# EasyEDA Pro project 第十届农装PCB工程.epro, board 驱动板_2024_8
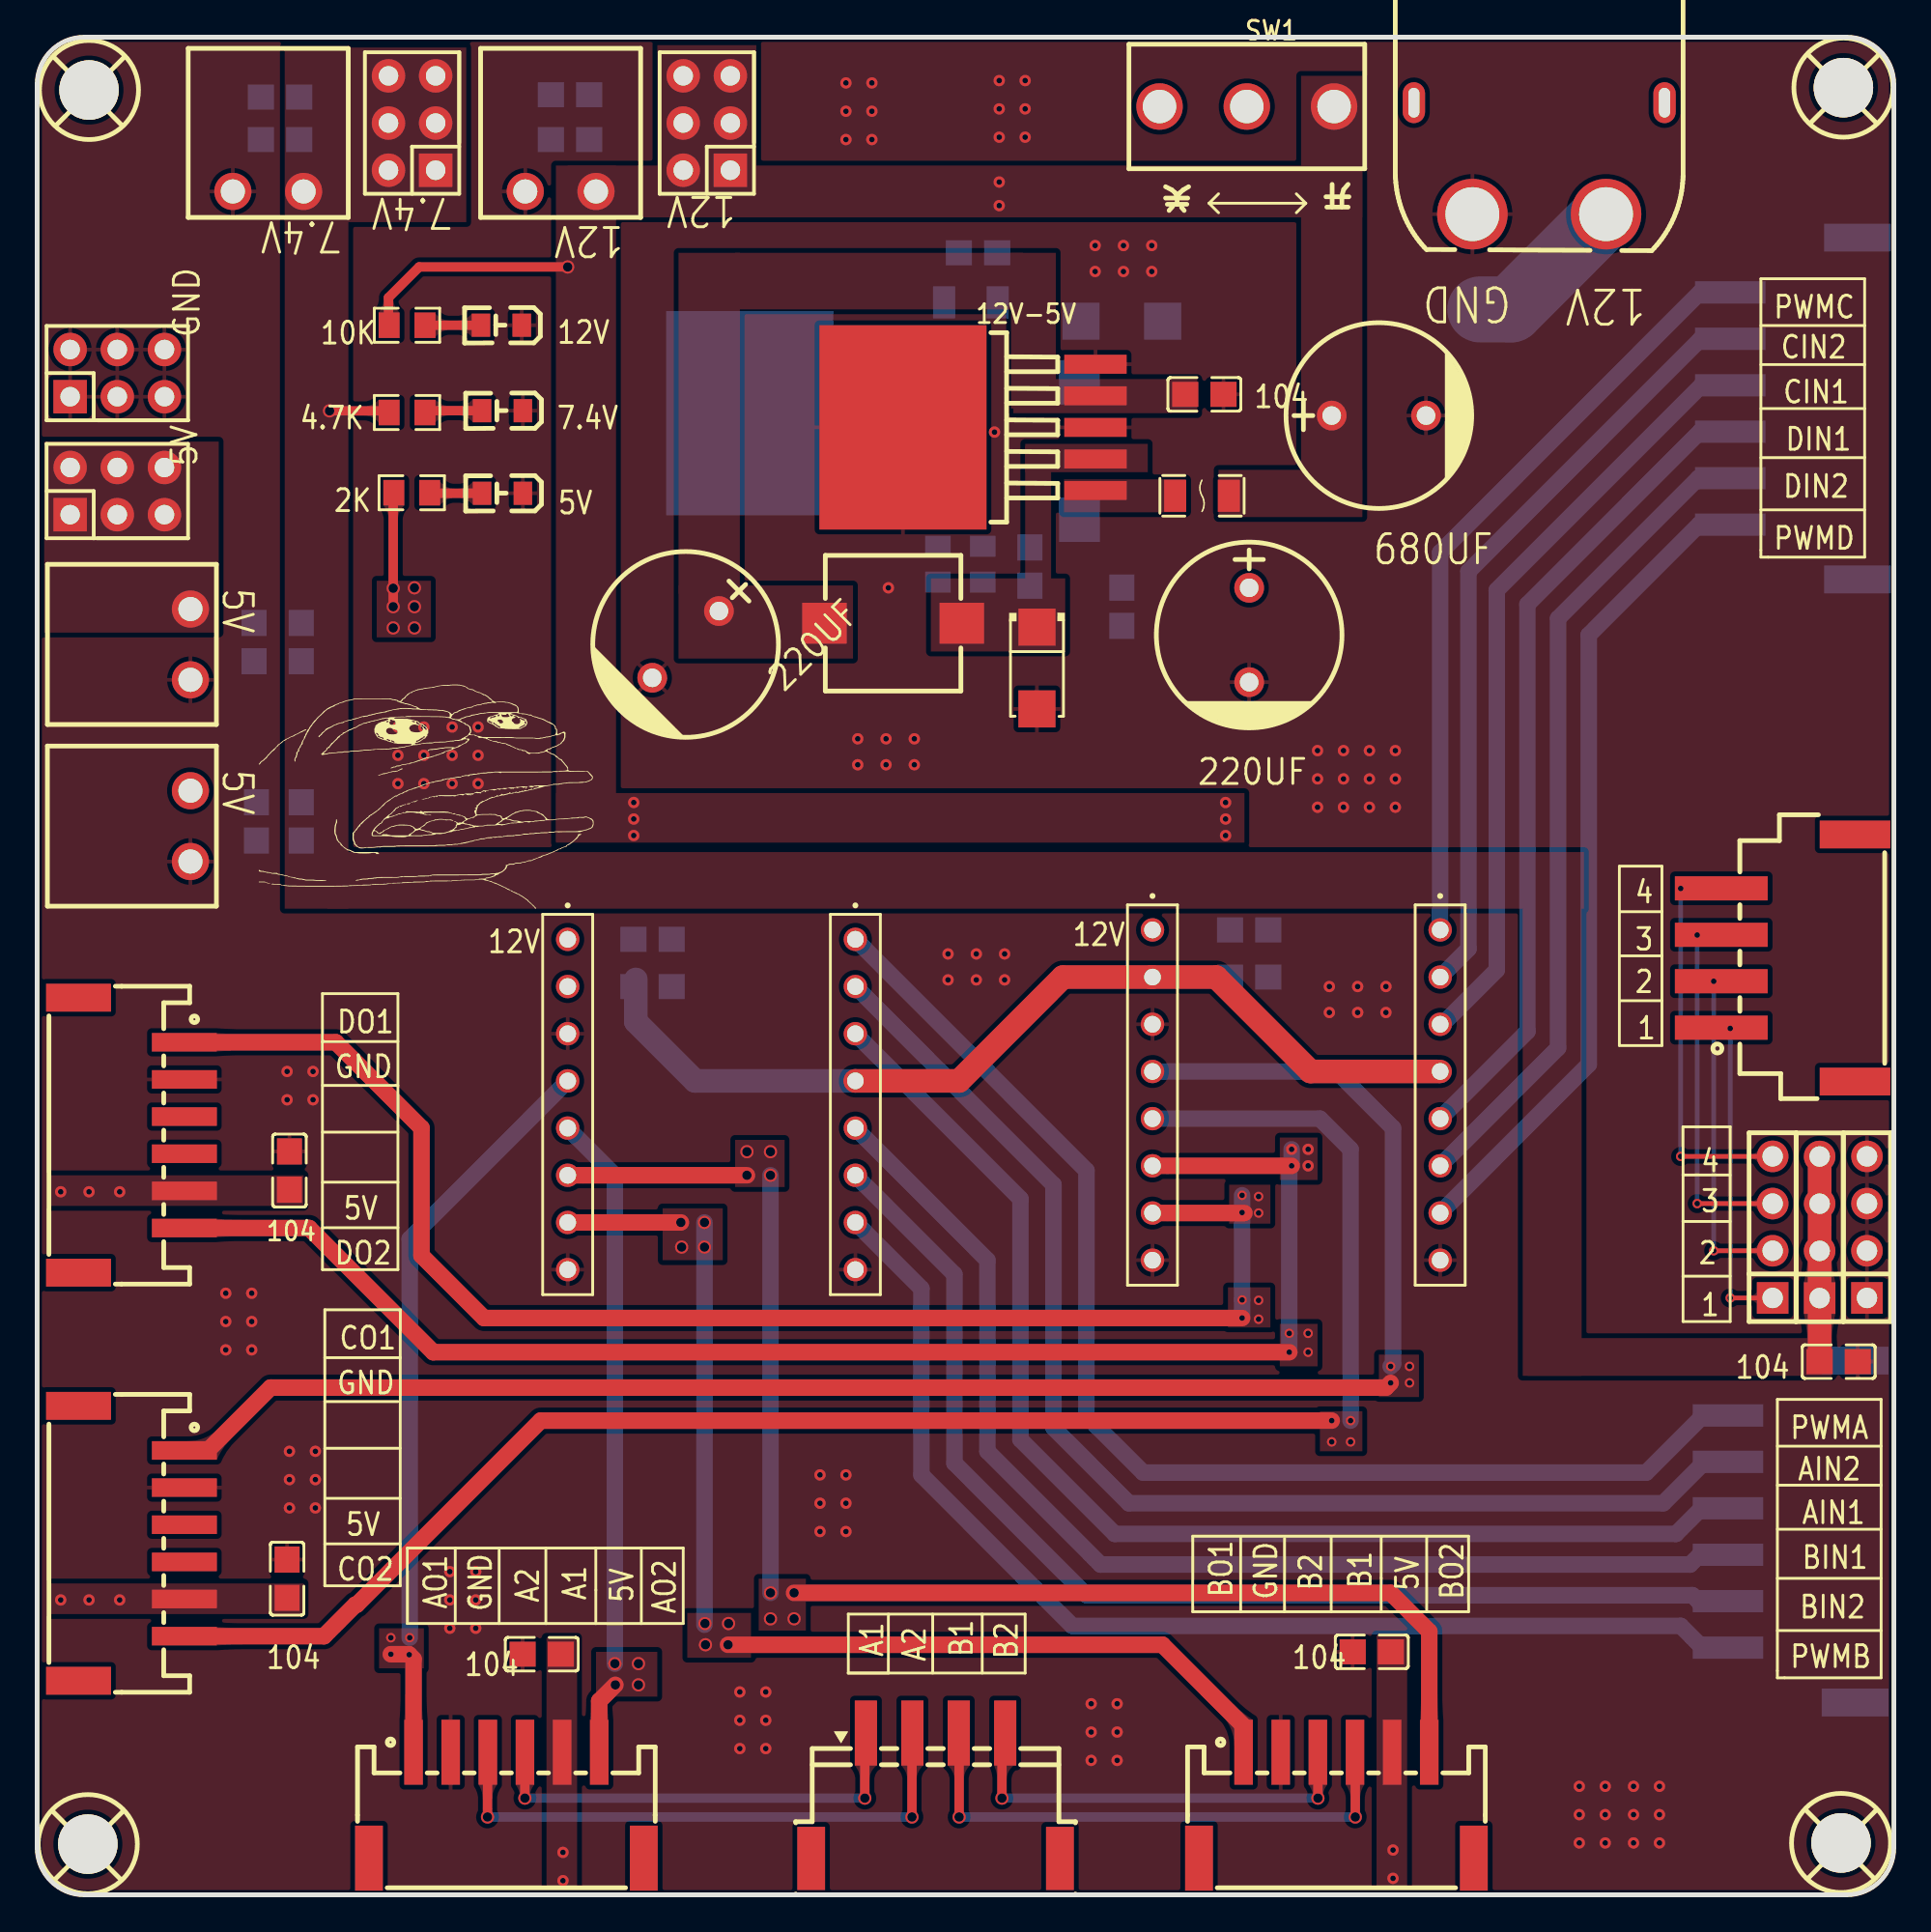
[diagram p3: board, top side]
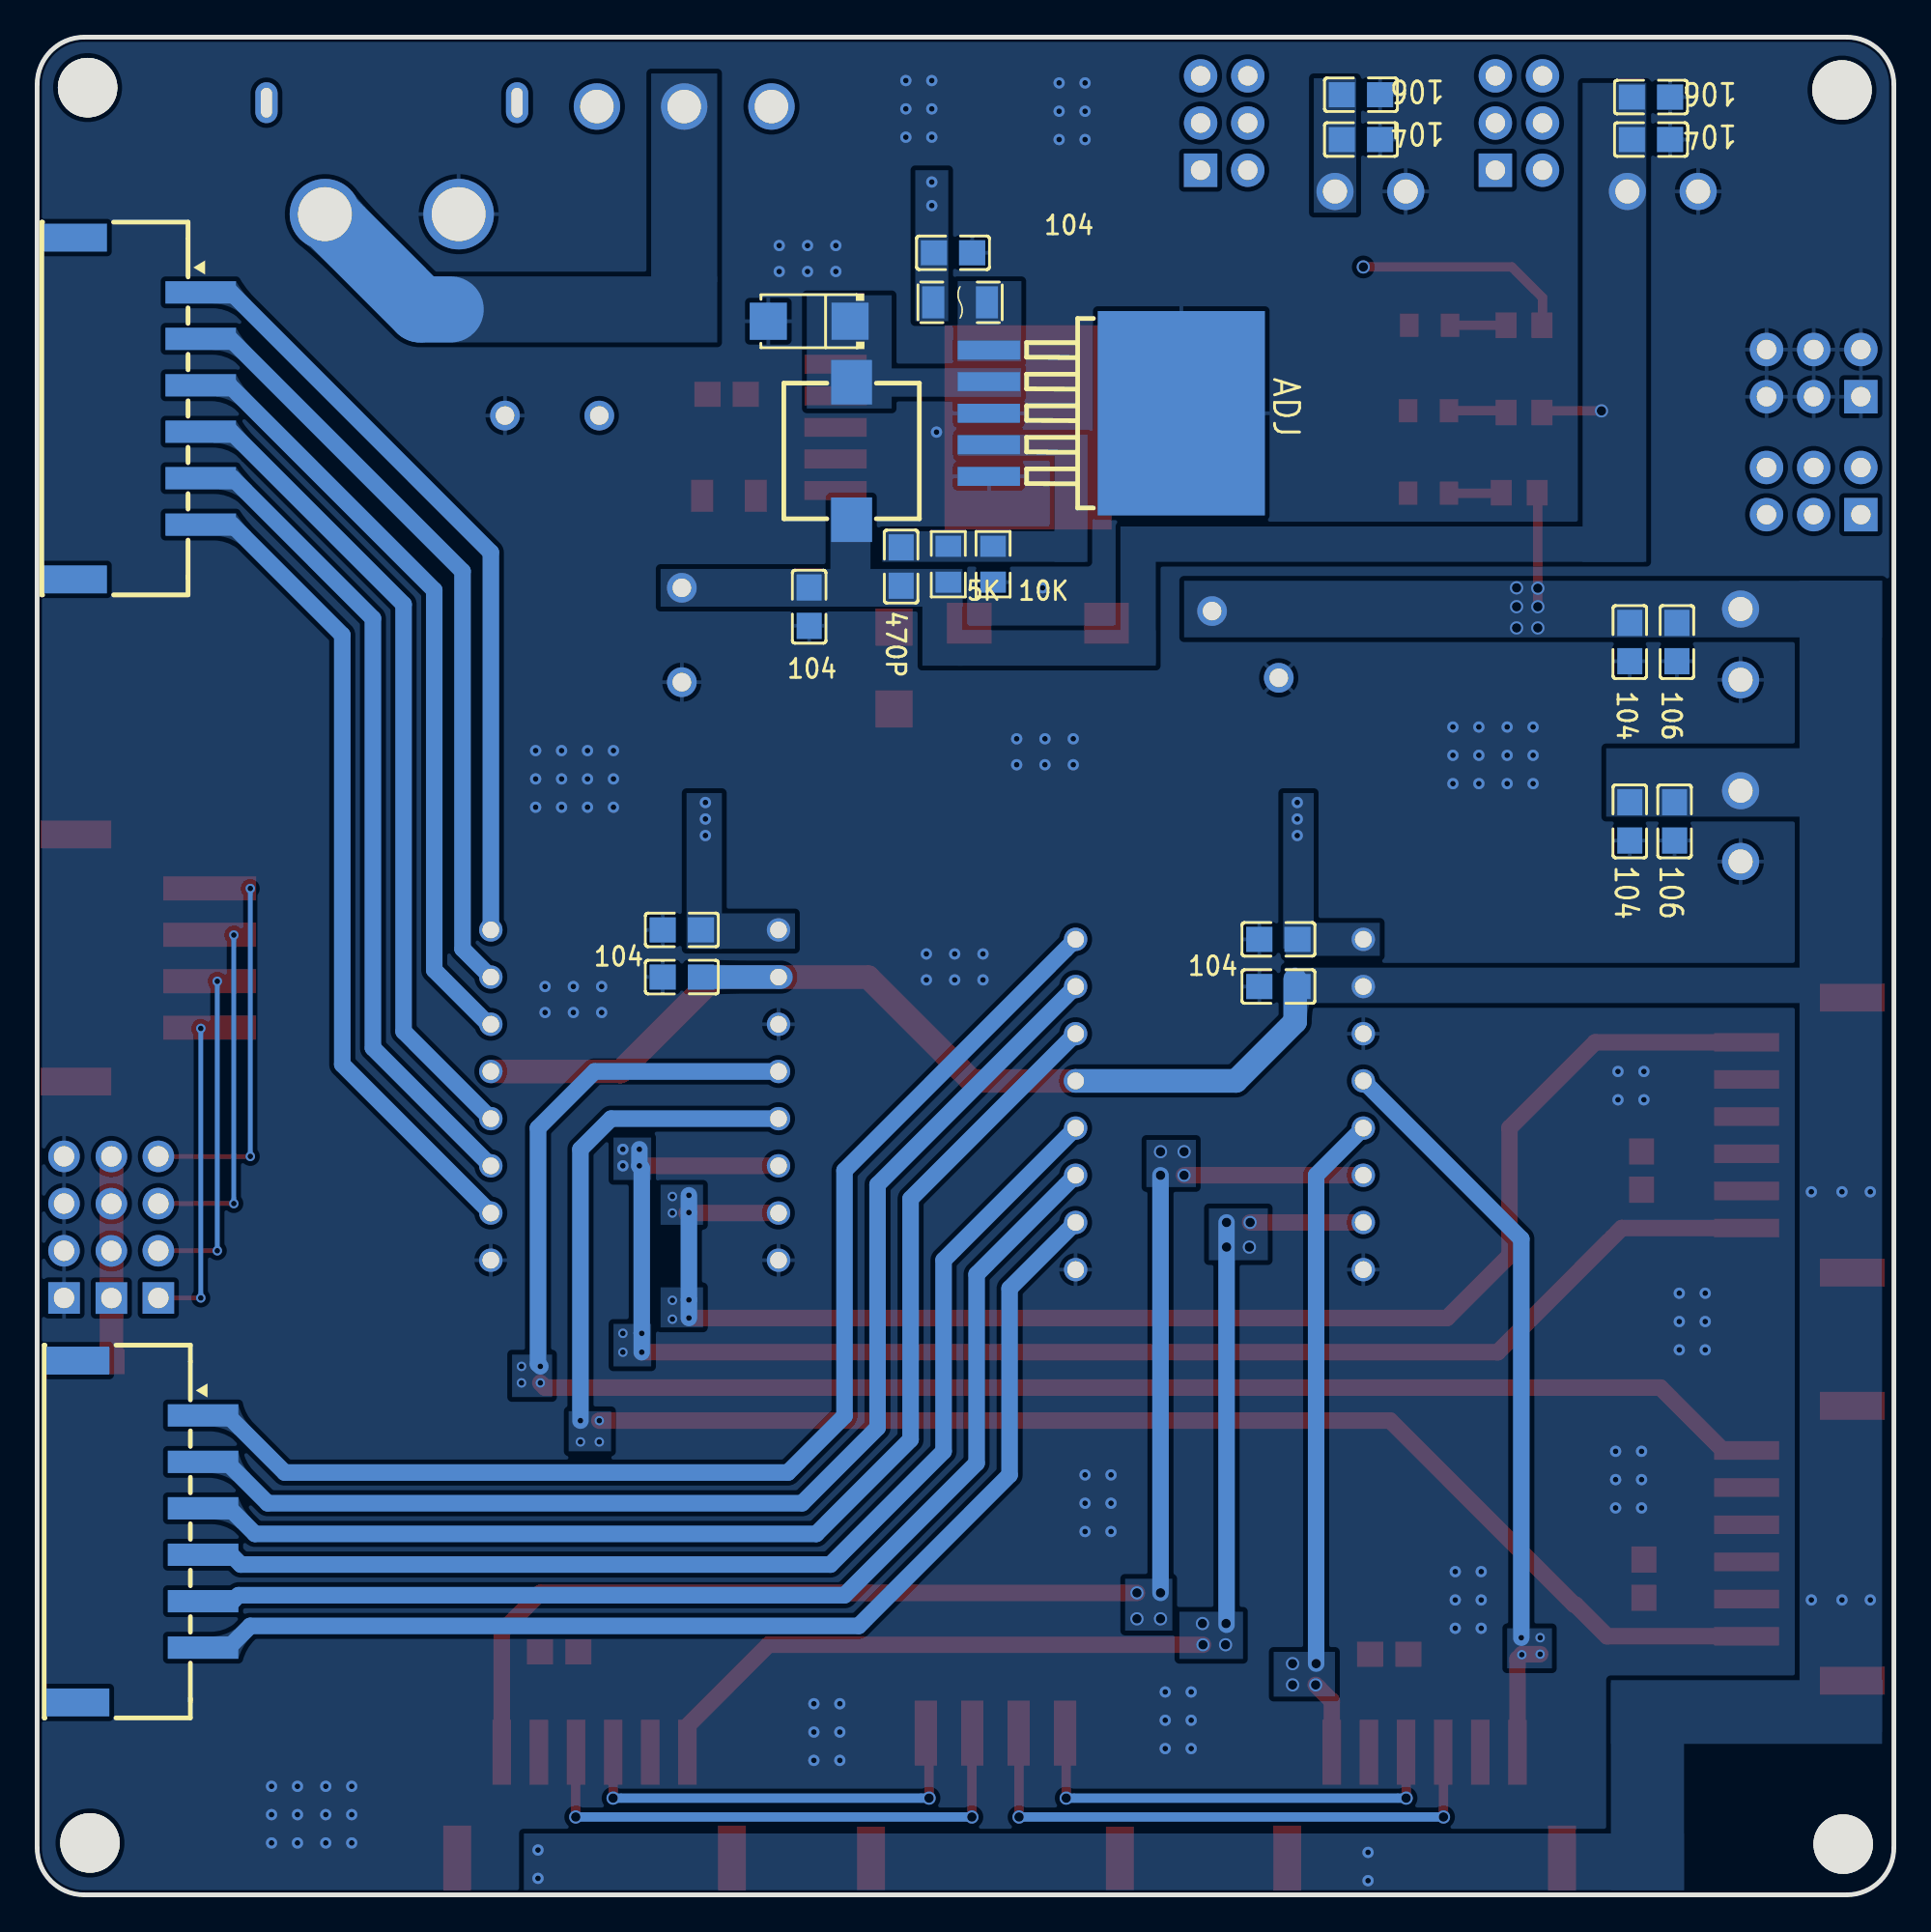
[diagram p4: board, bottom side, seen from below]

Outline 100 x 100 mm; copper layers: Top Layer, Bottom Layer. Coordinates in mm from the lower left corner of the outline.
Outline path: 0,97.46 0,2.54 arc(0.74,0.74) 2.54,0 97.46,0 arc(99.26,0.74) 100,2.54 100,97.46 arc(99.26,99.26) 97.46,100 2.54,100 arc(0.74,99.26) 0,97.46
Stack: Top Layer 0.035mm / Dielectric1 1.51mm FR4 er 4.5 / Bottom Layer 0.035mm

## Design rules (mm)
spacing Default (default): track to track 0.152, other pairs 0 to 0.152
track width Default (default): min 0.254, default 0.254, max 25.4
differential pair differentialPair (default): width min 0.127, default 0.254, max 2.54; gap min 0.152, default 0.152
via Default (default): diameter min 0.508, default 0.508, max 100.025; hole min 0.305, default 0.305, max 59.995
net GND uses gge22469
pour e268 uses gge22469

## Placement (name value [footprint] x y rotation side)
5K  TR0805D220KP0550Z  [R0805]  50.93 71.63 270 bottom
5V  A1-6PA-2.5DSA(71)  [HDR-TH_6P-P2.54-V-M-R2-C3-S2.54-1]  4.32 75.56 0 top
10K  TR0805D220KP0550Z  [R0805]  48.51 71.63 90 bottom
12  A1-6PA-2.5DSA(71)  [HDR-TH_6P-P2.54-V-M-R2-C3-S2.54-1]  36.07 95.38 90 top
12V-5V  LM2596S-5  [TO-263-5_L10.1-W8.7-P1.70-LS15.2-BR]  51.82 78.99 0 top
104  -  [C0805]  13.59 38.99 90 top
104#2  -  [C0805]  50.67 88.39 180 bottom
104#3  -  [C0805]  58.42 69.34 270 bottom
104#4  -  [C0805]  14.22 67.44 270 bottom
104#5  -  [C0805]  33.15 51.44 0 bottom
104#6  -  [C0805]  33.15 48.89 0 bottom
104#7  -  [C0805]  65.28 49.4 0 bottom
104#8  -  [C0805]  65.28 51.94 0 bottom
106  104  [C0805]  11.68 67.44 270 bottom
220UF  -  [CAP-TH_BD10.0-P5.00-D1.0-FD]  34.92 67.31 225 top
220UF#2  -  [CAP-TH_BD10.0-P5.00-D1.0-FD]  65.28 67.82 270 top
470P  104  [C0805]  53.47 71.5 90 bottom
ADJ  LM2596-ADJ  [TO-263-5_L10.1-W8.7-P1.70-LS15.2-BR]  43.56 79.76 0 bottom
C1  680uF  [CAP-TH_BD10.0-P5.00-D1.0-FD]  72.26 79.63 0 top
CN1  XY2500R-F-3.81-2P  [CONN-TH_XY2500R-F-3.81-2P]  28.19 91.69 180 top
CN2  XY2500R-F-3.81-2P  [CONN-TH_XY2500R-F-3.81-2P]  8.25 57.53 270 top
CN3  XY2500R-F-3.81-2P  [CONN-TH_XY2500R-F-3.81-2P]  8.25 67.31 270 top
CN4  XY2500R-F-3.81-2P  [CONN-TH_XY2500R-F-3.81-2P]  12.45 91.69 180 top
CN5  XT60PW-M  [CONN-TH_XT60PW-M]  80.9 93.47 270 top
D1  SS34  [SMA_L4.3-W2.6-LS5.2-RD]  53.85 66.04 270 top
D2  SS34  [SMA_L4.3-W2.6-LS5.2-RD]  58.42 84.71 0 bottom
F1  FSMD012-1206-R  [F1206]  62.74 75.31 180 top
F2  FSMD012-1206-R  [F1206]  50.29 85.72 180 bottom
FPC1  XH-4PWB  [CONN-SMD_4P-P2.50_DEALON_XH-4PWB]  94.31 50.43 90 top
GND  A1-6PA-2.5DSA(71)  [HDR-TH_6P-P2.54-V-M-R2-C3-S2.54-1]  4.32 81.91 0 top
H1  B2100R08PA001  [HDR-TH_4P-P2.54-V-M]  93.47 35.94 90 top
H1#2  -  [HDR-TH_4P-P2.54-V-M]  96 35.93 90 top
H1#3  -  [HDR-TH_4P-P2.54-V-M]  98.55 35.94 90 top
L1  331  [IND-SMD_L7.3-W7.3_CDRH74]  46.1 68.45 0 top
L2  331  [IND-SMD_L7.3-W7.3_CDRH74]  56.13 77.72 270 bottom
LED1  FC-2012HRK-620D  [LED0805-RD_RED]  25.06 75.45 180 top
LED2  FC-2012HRK-620D  [LED0805-RD_RED]  25.06 79.89 180 top
LED3  FC-2012HRK-620D  [LED0805-RD_RED]  25 84.49 180 top
R3  20k  [R0805]  19.92 84.49 180 top
R6  5K  [R0805]  20.18 75.48 180 top
R7  10k  [R0805]  19.92 79.79 180 top
SW1  SS-12D10L5  [SW-TH_SS-12D10L5]  65.15 96.27 0 top
TB1  2.54-6PWT  [COMM-SMD_6P-P2.50_SHOUHAN_2.54-6PWT]  94.49 19.56 270 bottom
TB2  2.54-6PWT  [COMM-SMD_6P-P2.50_SHOUHAN_2.54-6PWT]  94.61 80.01 270 bottom
TP1  -  [M3螺丝]  2.86 97.09 0 top
TP1#2  -  [M3螺丝]  97.35 97.22 0 top
TP1#3  -  [M3螺丝]  97.22 2.73 0 top
TP1#4  -  [M3螺丝]  2.79 2.67 0 top
U1  -  [CONN-SMD_6P-P2.00_ZX-PH2.0-WT6P]  69.98 4.83 0 top
U1#2  -  [CONN-SMD_6P-P2.00_ZX-PH2.0-WT6P]  5.08 18.92 270 top
U1#3  -  [CONN-SMD_6P-P2.00_ZX-PH2.0-WT6P]  5.08 40.89 270 top
U1#4  -  [CONN-SMD_6P-P2.00_ZX-PH2.0-WT6P]  25.27 4.83 0 top
U4  104  [C0805]  62.86 80.77 0 top
U8  106  [C0805]  28.7 94.49 180 bottom
U9  104  [C0805]  28.7 96.9 180 bottom
U12  104  [C0805]  11.81 57.78 270 bottom
U13  106  [C0805]  14.22 57.78 270 bottom
U18  -  [TB6612]  36.32 42.55 0 top
U19  -  [TB6612]  67.82 43.05 0 top
U26  Encoder_AB1  [COMM-SMD_4P-P2.50_SHOUHAN_2.54-4PWT]  48.39 5.33 0 top
U27  104  [C0805]  27.18 12.95 180 top
U28  104  [C0805]  71.88 13.08 180 top
U29  104  [C0805]  13.46 17.02 90 top
U31  106  [C0805]  13.08 94.49 180 bottom
U32  104  [C0805]  13.08 96.77 180 bottom
U33  A1-6PA-2.5DSA(71)  [HDR-TH_6P-P2.54-V-M-R2-C3-S2.54-1]  20.19 95.38 90 top
U36  104  [C0805]  97.03 28.7 180 top

## Footprints (pads in the part's own frame, mm; a bottom-side part is the same pattern mirrored in y, then rotated)
C0805
  rect 1.41x1.35 smd: 1(-1.03,0) 2(1.03,0)
CAP-TH_BD10.0-P5.00-D1.0-FD
  round 1.6 hole 1: 1(-2.54,0) 2(2.54,0)
COMM-SMD_4P-P2.50_SHOUHAN_2.54-4PWT
  rect 1.2x3.5 smd: 1(-3.75,3.375) 2(-1.25,3.375) 3(1.25,3.375) 4(3.75,3.375)
  rect 1.5x3.4 smd: 5(6.7,-3.375) 6(-6.7,-3.375)
COMM-SMD_6P-P2.50_SHOUHAN_2.54-6PWT
  rect 1.2x3.8 smd: 1(-6.25,3.425) 2(-3.75,3.425) 3(-1.25,3.425) 4(1.25,3.425) 5(3.75,3.425) 6(6.25,3.425)
  rect 1.5x3.6 smd: 7(9.2,-3.425) 8(-9.2,-3.425)
CONN-SMD_4P-P2.50_DEALON_XH-4PWB
  rect 1.3x5 smd: 1(-3.75,3.6) 2(-1.25,3.6) 3(1.25,3.6) 4(3.75,3.6)
  rect 1.5x3.8 smd: 5(-6.65,-3.6) 6(6.65,-3.6)
CONN-SMD_6P-P2.00_ZX-PH2.0-WT6P
  rect 1x3.5 smd: 1(-5,2.85) 2(-3,2.85) 3(-1,2.85) 4(1,2.85) 5(3,2.85) 6(5,2.85)
  rect 1.5x3.5 smd: 7(7.4,-2.85) 8(-7.4,-2.85)
CONN-TH_XT60PW-M
  round 3.8 hole 2.9: 1(3,-3.6) 2(3,3.6)
  oval 2.2x1.2 hole 1.6x0.6: 3(-3,6.75) 4(-3,-6.75)
CONN-TH_XY2500R-F-3.81-2P
  round 2 hole 1.3: 1(-1.905,0.001) 2(1.905,0.001)
F1206
  rect 1.19x1.728 smd: 1(-1.445,0) 2(1.445,0)
HDR-TH_4P-P2.54-V-M
  rect 1.7x1.7 hole 1.1: 1(-3.81,0)
  round 1.7 hole 1.1: 2(-1.27,0) 3(1.27,0) 4(3.81,0)
HDR-TH_6P-P2.54-V-M-R2-C3-S2.54-1
  rect 1.8x1.8 hole 1.05: 1(-2.54,-1.27)
  round 1.8 hole 1.05: 2(-2.54,1.27) 3(0,-1.27) 4(0,1.27) 5(2.54,-1.27) 6(2.54,1.27)
IND-SMD_L7.3-W7.3_CDRH74
  rect 2.4x2.2 smd: 1(-3.7,0) 2(3.7,0)
LED0805-RD_RED
  rect 1x1.25 smd: 1(-1.1,0) 2(1.1,0)
M3螺丝
  round 3.2 hole 3.2: 1(-0.064,0.064)
R0805
  rect 1.133x1.377 smd: 1(-0.966,0) 2(0.966,0)
SMA_L4.3-W2.6-LS5.2-RD
  rect 2x2 smd: 1(-2.2,0) 2(2.2,0)
SW-TH_SS-12D10L5
  round 2.5 hole 1.8: 1(-4.7,0) 2(0,0) 3(4.7,0)
TB6612
  round 1.26 hole 0.9: 1(-7.747,8.89) 2(-7.747,6.35) 3(-7.747,3.81) 4(-7.747,1.27) 5(-7.747,-1.27) 6(-7.747,-3.81) 7(-7.747,-6.35) 8(-7.747,-8.89) 9(7.747,-8.89) 10(7.747,-6.35) 11(7.747,-3.81) 12(7.747,-1.27) 13(7.747,1.27) 14(7.747,3.81) 15(7.747,6.35) 16(7.747,8.89)
TO-263-5_L10.1-W8.7-P1.70-LS15.2-BR
  rect 3.358x1.02 smd: 1(5.184,-3.4) 2(5.184,-1.7) 3(5.184,0) 4(5.184,1.7) 5(5.184,3.4)
  rect 9x11 smd: 6(-5.184,0)

## Nets
GND: 10K.1 12V-5V.3 12V-5V.5 12V-5V.6 104.2 104#2.2 104#3.2 104#4.2 104#5.2 104#6.2 104#7.2 104#8.2 106.2 220UF.2 220UF#2.2 ADJ.3 ADJ.5 ADJ.6 C1.2 CN1.2 CN2.2 CN3.2 CN4.2 CN5.1 D1.2 D2.2 GND.1 GND.2 GND.3 GND.4 GND.5 GND.6 H1#3.1 H1#3.2 H1#3.3 H1#3.4 LED1.1 LED2.1 LED3.1 U1.2 U1#2.2 U1#3.2 U1#4.2 U4.2 U8.2 U9.2 U12.2 U13.2 U18.3 U18.8 U18.9 U19.3 U19.8 U19.9 U27.2 U28.2 U29.2 U31.2 U32.2 U36.1
VCC5V: 5V.1 5V.2 5V.3 5V.4 5V.5 5V.6 12V-5V.4 104.1 104#4.1 104#6.1 104#7.1 106.1 220UF.1 CN2.1 CN3.1 L1.1 R6.2 U1.5 U1#2.5 U1#3.5 U1#4.5 U4.1 U12.1 U13.1 U18.2 U18.13 U19.2 U19.13 U27.1 U28.1 U29.1
VCC7.4V: 5K.2 104#3.1 220UF#2.1 470P.1 CN4.1 H1#2.1 H1#2.2 H1#2.3 H1#2.4 L2.2 R7.2 U31.1 U32.1 U33.1 U33.2 U33.3 U33.4 U33.5 U33.6 U36.2
AIN1: TB1.3 U18.14
AIN2: TB1.2 U18.15
AO1: U1#4.1 U18.4
AO2: U1#4.6 U18.5
BIN1: TB1.4 U18.12
BIN2: TB1.5 U18.11
BO1: U1.1 U18.7
BO2: U1.6 U18.6
CIN1: TB2.3 U19.14
CIN2: TB2.2 U19.15
CO1: U1#2.1 U19.4
CO2: U1#2.6 U19.5
DIN1: TB2.4 U19.12
DIN2: TB2.5 U19.11
DO1: U1#3.1 U19.7
DO2: U1#3.6 U19.6
ENCOA1: U1#4.4 U26.1
ENCOA2: U1#4.3 U26.2
ENCOB1: U1.4 U26.3
ENCOB2: U1.3 U26.4
LED3_2: LED3.2 R3.1
POWER12V: 12.1 12.2 12.3 12.4 12.5 12.6 104#2.1 104#5.1 104#8.1 C1.1 CN1.1 F1.1 F2.1 R3.2 SW1.3 U8.1 U9.1 U18.1 U19.1
POWER-12V: CN5.2 SW1.2
PWMA: TB1.1 U18.16
PWMB: TB1.6 U18.10
PWMC: TB2.1 U19.16
PWMD: TB2.6 U19.10
R6_1: LED1.2 R6.1
R7_1: LED2.2 R7.1
STEER1: FPC1.1 H1.1
STEER2: FPC1.2 H1.2
STEER3: FPC1.3 H1.3
STEER4: FPC1.4 H1.4
SW1_1: SW1.1
TB1_7: TB1.7
TB1_8: TB1.8
TB2_7: TB2.7
TB2_8: TB2.8
TB5_3: U1#2.3
TB5_4: U1#2.4
TB6_3: U1#3.3
TB6_4: U1#3.4
U2_1: 12V-5V.1 F1.2
U2_2: 12V-5V.2 D1.1 L1.2
U3_1: ADJ.1 F2.2
U3_2: ADJ.2 D2.1 L2.1
U3_4: 5K.1 10K.2 470P.2 ADJ.4
U26_5: U26.5
U26_6: U26.6

Pads without a net: CN5 3 4; FPC1 5 6; TP1 1; TP1#2 1; TP1#3 1; TP1#4 1; U1 7 8; U1#2 7 8; U1#3 7 8; U1#4 7 8

## Via types
v1: diameter 0.61, hole 0.305, Top Layer to Bottom Layer, 136 vias
v2: diameter 0.711, hole 0.508, Top Layer to Bottom Layer, 36 vias
v3: diameter 0.508, hole 0.305, Top Layer to Bottom Layer, 32 vias

## Routing (per net, layer and track width the routed paths; a pad name or vN(x,y) marks a point on that pad's centre or on a via; arc(x,y) is an arc through that point)
GND:
  vias: v1(10.16,32.38) v1(10.16,30.86) v1(10.16,29.34) v1(11.56,32.38) v1(11.56,30.86) v1(11.56,29.34) v1(13.46,44.32) v1(13.46,42.8) v1(13.59,23.88) v1(13.59,22.35) v1(13.59,20.83) v1(14.86,44.32) v1(14.86,42.8) v1(14.99,23.88) v1(14.99,22.35) v1(14.99,20.83) v1(19.43,62.86) v1(19.43,61.34) v1(19.43,59.82) v1(20.83,62.86) v1(20.83,61.34) v1(20.83,59.82) v1(22.22,17.4) v1(22.22,15.88) v1(22.22,14.35) v1(22.35,62.86) v1(22.35,61.34) v1(22.35,59.82) v1(23.62,17.4) v1(23.62,15.88) v1(23.62,14.35) v1(23.75,62.86) v1(23.75,61.34) v1(23.75,59.82) v1(37.85,10.92) v1(37.85,9.4) v1(37.85,7.87) v1(39.24,10.92) v1(39.24,9.4) v1(39.24,7.87) v1(42.16,22.61) v1(42.16,21.08) v1(42.16,19.56) v1(43.56,97.54) v1(43.56,96.01) v1(43.56,94.49) v1(43.56,22.61) v1(43.56,21.08) v1(43.56,19.56) v1(44.2,62.23) v1(44.2,60.83) v1(44.96,97.54) v1(44.96,96.01) v1(44.96,94.49) v1(45.72,62.23) v1(45.72,60.83) v1(45.85,70.36) v1(47.24,62.23) v1(47.24,60.83) v1(49.06,50.65) v1(49.06,49.25) v1(50.58,50.65) v1(50.58,49.25) v1(51.56,78.74) v1(51.82,97.66) v1(51.82,96.14) v1(51.82,94.61) v1(52.11,50.65) v1(52.11,49.25) v1(53.21,97.66) v1(53.21,96.14) v1(53.21,94.61) v1(56.77,10.29) v1(56.77,8.76) v1(56.77,7.24) v1(56.98,88.78) v1(56.98,87.38) v1(58.17,10.29) v1(58.17,8.76) v1(58.17,7.24) v1(58.51,88.78) v1(58.51,87.38) v1(60.03,88.78) v1(60.03,87.38) v1(68.96,61.59) v1(68.96,60.07) v1(68.96,58.55) v1(69.6,48.89) v1(69.6,47.5) v1(70.36,61.59) v1(70.36,60.07) v1(70.36,58.55) v1(71.12,48.89) v1(71.12,47.5) v1(71.75,61.59) v1(71.75,60.07) v1(71.75,58.55) v1(72.64,48.89) v1(72.64,47.5) v1(73.15,61.59) v1(73.15,60.07) v1(73.15,58.55) v1(83.06,5.84) v1(83.06,4.32) v1(83.06,2.79) v1(84.45,5.84) v1(84.45,4.32) v1(84.45,2.79) v1(85.98,5.84) v1(85.98,4.32) v1(85.98,2.79) v1(87.38,5.84) v1(87.38,4.32) v1(87.38,2.79)
VCC5V: length 61.8
  Top Layer w0.508: v2(19.18,69.34) v2(19.18,70.33) 19.18,75.44 R6.2
  Top Layer w1.27: 75.44,44.32 68.58,44.32 63.5,49.4 59.94,49.4 ; 44.07,43.81 49.66,43.81 55.24,49.4 U19.2
  Bottom Layer w1.27: 32.24,49.28 32.24,47 35.43,43.81 44.07,43.81 ; 59.94,49.4 104#7.1
  vias: v1(1.27,37.85) v1(1.27,15.88) v1(2.79,37.85) v1(2.79,15.88) v1(4.44,37.85) v1(4.44,15.88) v1(28.32,2.29) v1(28.32,0.76) v1(73.02,2.41) v1(73.02,0.89) v2(19.18,68.2) v2(20.32,70.36) v2(20.32,69.34) v2(20.32,68.2)
VCC7.4V: length 14.2
  Top Layer w0.508: 18.87,79.88 v2(15.75,79.88)
  Top Layer w1.27: 96,39.74 H1#2.3 H1#2.2 U36.2
AIN1: length 66.3
  Bottom Layer w0.889: TB1.3 89.64,20.81 88.27,19.43 58.04,19.43 52.96,24.51 52.96,37.47 44.07,46.36
AIN2: length 67.1
  Bottom Layer w0.889: 44.07,48.89 54.74,38.23 54.74,25.15 58.8,21.08 87.58,21.08 89.81,23.31 91.06,23.31
AO1: length 40
  Top Layer w0.889: U1#4.1 20.27,12.69 v3(20.04,12.93) 20.01,12.95 v3(19.05,12.95)
  Bottom Layer w0.889: v3(20.07,13.84) 20.07,35.31 28.7,43.94
  vias: v3(19.05,13.84)
AO2: length 33.9
  Top Layer w0.889: v2(31.14,11.3) 30.27,10.43 U1#4.6
  Bottom Layer w0.889: U18.5 31.11,38.73 v2(31.11,12.45)
  vias: v2(32.39,12.45) v2(32.39,11.3)
BIN1: length 63
  Bottom Layer w0.889: 44.07,41.27 51.18,34.16 51.18,23.88 57.28,17.78 89.03,17.78 89.55,18.31 TB1.4
BIN2: length 62.4
  Bottom Layer w0.889: TB1.5 89.48,15.81 89.15,16.13 56.52,16.13 49.4,23.24 49.4,33.4 44.07,38.73
BO1: length 58.8
  Top Layer w0.889: 65.02,7.46 65.02,9.04 60.61,13.46 v2(37.21,13.46) ; 28.7,36.19 v2(34.67,36.19)
  Bottom Layer w0.889: 35.94,14.54 v2(35.94,36.19)
  vias: v2(34.71,34.87) v2(35.94,34.87) v2(35.97,14.6) v2(35.99,13.46) v2(37.24,14.6)
BO2: length 73.7
  Top Layer w0.889: U1.6 74.98,14.18 72.9,16.26 v2(40.77,16.26) ; U18.6 v2(38.23,38.73)
  Bottom Layer w0.889: v2(39.5,38.73) v2(39.5,16.26)
  vias: v2(38.23,40) v2(39.5,40) v2(39.5,14.86) v2(40.77,14.86)
CIN1: length 41.9
  Bottom Layer w0.889: U19.14 75.69,46.86 78.61,49.78 78.61,70.23 89.64,81.26 TB2.3
CIN2: length 41.8
  Bottom Layer w0.889: TB2.2 89.6,83.76 77.09,71.25 77.09,50.93 U19.15
CO1: length 93.6
  Top Layer w0.889: v3(72.9,27.56) 72.64,27.3 12.57,27.3 9.19,23.92 U1#2.1
  Bottom Layer w0.889: v3(72.9,28.45) 73.02,28.58 73.02,41.27 69.98,44.32 U19.4
  vias: v3(73.91,28.45) v3(73.91,27.56)
CO2: length 92.6
  Top Layer w0.889: U1#2.6 15.45,13.92 17.14,15.62 17.22,15.62 27.12,25.53 v3(69.72,25.53)
  Bottom Layer w0.889: v3(70.74,25.53) 70.74,40.13 69.09,41.78 U19.5
  vias: v3(69.72,24.38) v3(70.74,24.38)
DIN1: length 44.4
  Bottom Layer w0.889: U19.12 80.26,46.48 80.26,69.47 89.56,78.76 91.19,78.76
DIN2: length 44.5
  Bottom Layer w0.889: 91.19,76.26 89.47,76.26 81.92,68.71 81.92,45.59 U19.11
DO1: length 78.8
  Top Layer w0.889: v3(64.9,31.05) 24.07,31.05 20.7,34.42 20.7,41.28 16.09,45.89 U1#3.1 ; 59.94,36.7 65.02,36.7
  Bottom Layer w0.889: v3(64.9,37.66) v3(64.9,36.73) v3(64.9,32.03) v3(64.9,31.05)
  vias: v3(65.79,37.59) v3(65.79,36.7) v3(65.79,32) v3(65.79,30.99)
DO2: length 80.9
  Top Layer w0.889: U1#3.6 14.65,35.89 21.34,29.21 v3(67.44,29.21) ; 59.94,39.24 v1(67.56,39.24)
  Bottom Layer w0.889: v3(67.44,29.21) v3(67.44,30.23) 67.44,39.12 v1(67.56,39.24) v1(67.56,40.13)
  vias: v1(68.45,40.13) v1(68.45,39.24) v3(68.45,30.23) v3(68.45,29.21)
ENCOA1: length 25
  Top Layer w0.508: 26.27,8.38 v2(26.27,5.21) ; U26.1 44.58,8.65 v2(44.58,5.21)
  Bottom Layer w0.508: v2(26.27,5.21) v2(44.58,5.21)
ENCOA2: length 31.6
  Top Layer w0.508: 24.26,8.4 v2(24.26,4.19) ; v2(47.12,4.19) 47.12,8.74 47.14,8.76
  Bottom Layer w0.508: v2(24.26,4.19) v2(47.12,4.19)
ENCOB1: length 30.2
  Top Layer w0.508: 49.53,8.63 49.66,8.5 v2(49.66,4.19) ; v2(70.99,4.19) 70.99,8.52
  Bottom Layer w0.508: v2(70.99,4.19) v2(49.66,4.19)
ENCOB2: length 23.9
  Top Layer w0.508: 68.98,8.5 v2(68.98,5.21) ; 51.96,8.76 v2(51.96,5.21)
  Bottom Layer w0.508: v2(51.96,5.21) v2(68.98,5.21)
LED3_2: length 3
  Top Layer w0.508: 20.89,84.49 LED3.2
POWER12V: length 11.8
  Top Layer w0.508: v2(28.57,87.63) 20.57,87.63 18.92,85.98 18.92,84.53 R3.2
  vias: v1(32.13,58.8) v1(32.13,57.91) v1(32.13,57.02) v1(51.82,92.2) v1(51.82,90.93) v1(64.01,58.8) v1(64.01,57.91) v1(64.01,57.02)
POWER-12V: length 8.9
  Bottom Layer w3.556: 77.72,85.34 79.37,85.34 CN5.2
PWMA: length 67.9
  Bottom Layer w0.889: 44.07,51.44 56.52,38.99 56.52,25.78 59.56,22.73 86.67,22.73 89.74,25.81 91.06,25.81
PWMB: length 62.4
  Bottom Layer w0.889: TB1.6 89.69,13.31 88.52,14.48 55.75,14.48 47.62,22.61 47.62,32.64 44.07,36.19
PWMC: length 41.7
  Bottom Layer w0.889: 91.19,86.26 89.56,86.26 75.56,72.26 U19.16
PWMD: length 44.5
  Bottom Layer w0.889: TB2.6 89.51,73.76 83.57,67.82 83.57,44.7 U19.10
R6_1: length 2.8
  Top Layer w0.508: LED1.2 21.17,75.45 R6.1
R7_1: length 3.1
  Top Layer w0.508: R7.1 20.99,79.89 LED2.2
STEER1: length 16.8
  Top Layer w0.254: v3(91.19,32.13) H1.1
  Bottom Layer w0.254: v3(91.19,32.13) v3(91.19,46.64)
STEER2: length 17.7
  Top Layer w0.254: v3(90.3,34.67) H1.2
  Bottom Layer w0.254: v3(90.3,34.67) v3(90.3,49.18)
STEER3: length 18.5
  Top Layer w0.254: v3(89.41,37.21) H1.3
  Bottom Layer w0.254: v3(89.41,37.21) v3(89.41,51.67)
STEER4: length 19.4
  Top Layer w0.254: v3(88.52,39.75) H1.4
  Bottom Layer w0.254: v3(88.52,39.75) v3(88.52,54.17)

## Copper pours and planes (outline as drawn; the poured copper is in the pictures)
GND on Top Layer: 128.9,-8.13 128.14,-8.89 -2.54,-8.89 -5.21,-6.22 -5.21,115.06 -12.32,115.06 -2.79,124.59 110.87,124.59 128.9,106.55
GND on Bottom Layer: -17.53,110.11 -17.53,-3.94 -13.46,-8 110.24,-8 111.51,-6.73 111.51,105.41 105.03,111.89 -9.78,111.89 -11.81,109.85
VCC5V on Top Layer: 0.76,38.73 14.35,38.73 14.35,37.08 0.76,37.08
VCC5V on Top Layer: 27.43,13.84 29.08,13.84 29.08,0.38 27.43,0.38
VCC5V on Top Layer: 34.54,70.48 43.94,70.48 43.94,66.55 34.54,66.55
VCC5V on Top Layer: 34.54,88.39 37.85,88.39 37.85,70.04 34.54,70.04
VCC5V on Top Layer: 0.38,78.23 9.78,78.23 9.78,67.94 0.38,67.94
VCC5V on Top Layer: 52.58,81.6 62.48,81.6 62.48,79.76 52.58,79.76
VCC5V on Top Layer: 37.59,88.39 53.09,88.39 53.09,85.34 37.59,85.34
VCC5V on Top Layer: 18.29,70.74 21.21,70.74 21.21,67.69 18.29,67.69
VCC5V on Top Layer: 52.45,88.39 54.86,88.39 54.86,80.01 52.45,80.01
VCC5V on Top Layer: 0.76,16.76 14.35,16.76 14.35,15.11 0.76,15.11
VCC5V on Top Layer: 72.14,13.97 73.79,13.97 73.79,0.38 72.14,0.38
VCC5V on Bottom Layer: 11.3,11.43 15.24,11.43 15.24,0.25 11.3,0.25
VCC5V on Bottom Layer: 11.3,3.3 73.79,3.3 73.79,0.25 11.3,0.25
VCC5V on Bottom Layer: 0.63,11.56 15.24,11.56 15.24,8.13 0.63,8.13
VCC5V on Bottom Layer: 4.19,49.91 32.77,49.91 32.77,48.01 4.19,48.01
VCC5V on Bottom Layer: 0.63,70.74 38.23,70.74 38.23,67.69 0.63,67.69
VCC5V on Bottom Layer: 2.67,61.72 15.49,61.72 15.49,58.04 2.67,58.04
VCC5V on Bottom Layer: 0.63,70.74 5.08,70.74 5.08,8.76 0.63,8.76
VCC7.4V on Top Layer: 80.01,56.01 83.18,56.01 83.18,27.94 80.01,27.94
VCC7.4V on Top Layer: 80.26,29.97 96.65,29.97 96.65,27.94 80.26,27.94
VCC7.4V on Top Layer: 13.33,90.42 16.76,90.42 16.76,53.09 13.33,53.09
VCC7.4V on Top Layer: 15.62,56.13 83.31,56.13 83.31,53.09 15.62,53.09
VCC7.4V on Top Layer: 13.33,99.44 23.11,99.44 23.11,90.04 13.33,90.04
VCC7.4V on Bottom Layer: 50.17,71.25 52.32,71.25 52.32,66.17 50.17,66.17
VCC7.4V on Bottom Layer: 50.17,71.37 66.42,71.37 66.42,69.34 50.17,69.34
VCC7.4V on Bottom Layer: 55.12,75.18 57.28,75.18 57.28,70.61 55.12,70.61
VCC7.4V on Bottom Layer: 13.46,73.66 40,73.66 40,71.75 13.46,71.75
VCC7.4V on Bottom Layer: 13.33,97.54 16.76,97.54 16.76,71.75 13.33,71.75
VCC7.4V on Bottom Layer: 39.75,73.66 41.66,73.66 41.66,66.29 39.75,66.29
VCC7.4V on Bottom Layer: 39.75,68.07 50.42,68.07 50.42,66.17 39.75,66.17
AO1 on Top Layer: 18.41,14.35 20.83,14.35 20.83,12.19 18.41,12.19
AO1 on Bottom Layer: 18.41,14.35 20.83,14.35 20.83,12.19 18.41,12.19
AO2 on Top Layer: 30.1,13.08 33.4,13.08 33.4,10.67 30.1,10.67
AO2 on Bottom Layer: 30.1,13.08 33.4,13.08 33.4,10.67 30.1,10.67
BO1 on Top Layer: 35.02,15.18 38.44,15.18 38.44,12.76 35.02,12.76
BO1 on Top Layer: 33.69,36.96 36.92,36.96 36.92,34.16 33.69,34.16
BO1 on Bottom Layer: 33.72,36.96 36.89,36.96 36.89,34.16 33.72,34.16
BO1 on Bottom Layer: 35.05,15.24 38.48,15.24 38.48,12.7 35.05,12.7
BO2 on Top Layer: 37.59,40.64 40.26,40.64 40.26,38.1 37.59,38.1
BO2 on Top Layer: 38.86,17.02 41.4,17.02 41.4,14.22 38.86,14.22
BO2 on Bottom Layer: 37.59,40.64 40.26,40.64 40.26,38.1 37.59,38.1
BO2 on Bottom Layer: 38.86,17.02 41.4,17.02 41.4,14.22 38.86,14.22
CO1 on Top Layer: 72.26,29.08 74.42,29.08 74.42,26.8 72.26,26.8
CO1 on Bottom Layer: 72.26,29.08 74.42,29.08 74.42,26.8 72.26,26.8
CO2 on Top Layer: 69.09,26.03 71.37,26.03 71.37,23.88 69.09,23.88
CO2 on Bottom Layer: 69.09,26.03 71.37,26.03 71.37,23.88 69.09,23.88
DO1 on Top Layer: 64.14,32.7 66.42,32.7 66.42,30.54 64.14,30.54
DO1 on Top Layer: 64.2,38.23 66.42,38.23 66.42,36.13 64.2,36.13
DO1 on Bottom Layer: 64.14,38.23 66.42,38.23 66.42,36.07 64.14,36.07
DO1 on Bottom Layer: 64.14,32.7 66.42,32.7 66.42,30.54 64.14,30.54
DO2 on Top Layer: 66.93,40.77 68.96,40.77 68.96,38.48 66.93,38.48
DO2 on Top Layer: 66.93,30.73 68.96,30.73 68.96,28.45 66.93,28.45
DO2 on Bottom Layer: 66.93,40.77 68.96,40.77 68.96,38.48 66.93,38.48
DO2 on Bottom Layer: 66.93,30.73 68.96,30.73 68.96,28.45 66.93,28.45
POWER12V on Top Layer: 63.63,76.71 71.37,76.71 71.37,74.17 63.63,74.17
POWER12V on Top Layer: 33.4,99.57 38.73,99.57 38.73,90.42 33.4,90.42
POWER12V on Top Layer: 68.07,97.92 71.37,97.92 71.37,75.06 68.07,75.06
POWER12V on Top Layer: 27.94,59.31 65.02,59.31 65.02,56.64 27.94,56.64
POWER12V on Top Layer: 27.94,93.09 31.18,93.09 31.18,56.71 27.94,56.71
POWER12V on Top Layer: 28.57,93.09 71.37,93.09 71.37,90.3 28.57,90.3
POWER12V on Bottom Layer: 31.24,59.31 32.89,59.31 32.89,50.93 31.24,50.93
POWER12V on Bottom Layer: 63.12,59.31 65.02,59.31 65.02,50.93 63.12,50.93
POWER12V on Bottom Layer: 50.93,92.84 52.7,92.84 52.7,84.71 50.93,84.71
POWER12V on Bottom Layer: 27.69,52.32 32.77,52.32 32.77,50.55 27.69,50.55
POWER12V on Bottom Layer: 59.18,52.83 64.77,52.83 64.77,50.93 59.18,50.93
POWER12V on Bottom Layer: 28.96,97.79 31.24,97.79 31.24,90.55 28.96,90.55
POWER-12V on Bottom Layer: 63.37,98.04 66.93,98.04 66.93,86.8 63.37,86.8
POWER-12V on Bottom Layer: 63.37,87.12 79.25,87.12 79.25,83.57 63.37,83.57
U2_1 on Top Layer: 55.31,76.2 61.85,76.2 61.85,74.42 55.31,74.42
U2_2 on Top Layer: 48.13,70.87 55.37,70.87 55.37,66.93 48.13,66.93
U2_2 on Top Layer: 53.21,78.11 59.82,78.11 59.82,76.58 53.21,76.58
U2_2 on Top Layer: 53.21,77.98 54.61,77.98 54.61,69.85 53.21,69.85
U3_1 on Bottom Layer: 46.99,86.87 50.42,86.87 50.42,82.55 46.99,82.55
U3_2 on Bottom Layer: 53.98,86.11 58.55,86.11 58.55,80.01 53.98,80.01
U3_2 on Bottom Layer: 46.99,82.17 55.24,82.17 55.24,80.64 46.99,80.64
U3_4 on Bottom Layer: 43.56,73.41 54.48,73.41 54.48,71.75 43.56,71.75
U3_4 on Bottom Layer: 43.43,78.61 45.21,78.61 45.21,71.75 43.43,71.75
U3_4 on Bottom Layer: 43.56,78.61 50.42,78.61 50.42,77.47 43.56,77.47

Small or netless copper shapes (teardrops, artwork), in the pictures only: 58 on Top Layer, 45 on Bottom Layer

## Text on the board
Bottom Silkscreen Layer: 106 | 104
Top Silkscreen Layer: 4 | 3 | 2 | 1 | 104 | 4.7K | 10K | 2K | GND | DO2 | DO1 | CO2 | CO1 | 5V | 12V | 7.4V | PWMC | PWMD | CIN2 | CIN1 | DIN2 | DIN1 | PWMA | PWMB | AIN2 | BIN2 | AIN1 | BIN1 | AO1 | A2 | A1 | AO2 | B1 | B2 | BO1 | BO2 | 680UF | 关 | 开
